# EAGLE design Gen7Extension (EAGLE 6.5.0)
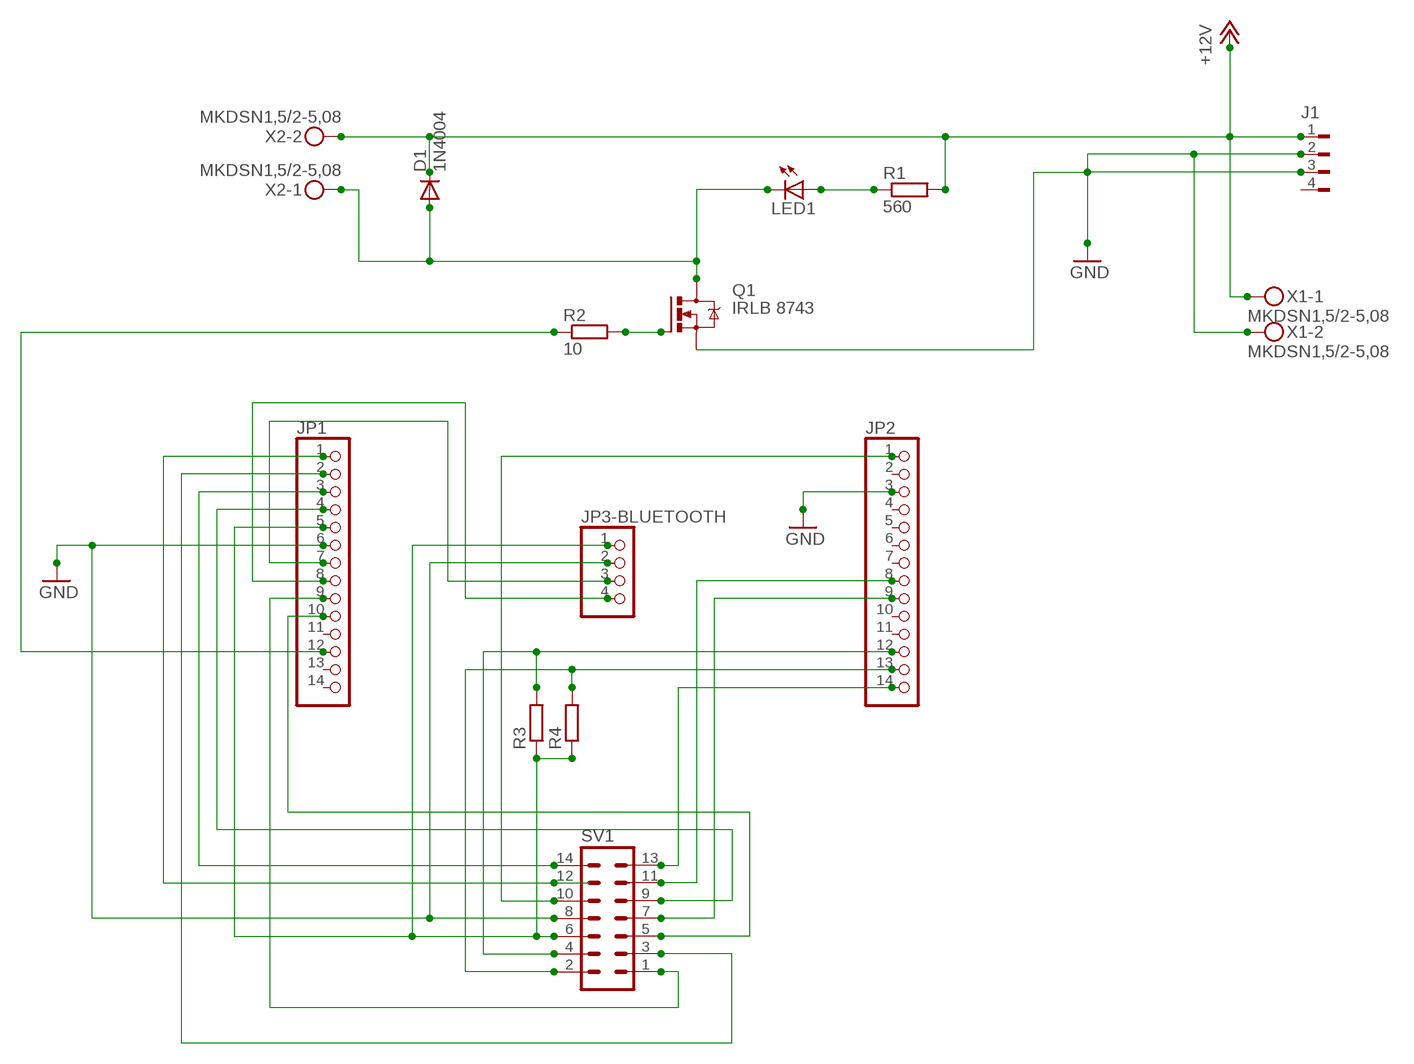
[diagram p0: schematic, sheet 1]

## Parts
D1  1N4004  [DO41-10]
J1  FLOPPY-4  [FLOPPY-4]
JP1  PINHD-1X14  [1X14]
JP2  PINHD-1X14  [1X14]
JP3-BLUETOOTH  PINHD-1X4  [1X04]
LED1  LED3MM  [LED3MM]
Q1  IRLB 8743  IRF530  [TO220BV]
R1  560  R-EU_0207/10  [0207/10]
R2  10  R-EU_0207/10  [0207/10]
R3  R-EU_0207/5V  [0207/5V]
R4  R-EU_0207/2V  [0207/2V]
SV1  ML14  [ML14]
X1  MKDSN1,5/2-5,08  [MKDSN1,5/2-5,08]
X2  MKDSN1,5/2-5,08  [MKDSN1,5/2-5,08]

## Nets
+12V: D1.C J1.1 R1.2 X1.1 X2.2
GND: J1.2 J1.3 JP1.6 JP2.3 JP3-BLUETOOTH.2 Q1.S SV1.8 X1.2
N$1: JP1.1 SV1.12
N$2: JP1.2 SV1.3
N$3: JP1.3 SV1.14
N$4: JP1.4 SV1.9
N$5: JP1.5 JP3-BLUETOOTH.1 R3.1 R4.1 SV1.6
N$6: JP1.7 JP3-BLUETOOTH.3
N$7: JP1.8 JP3-BLUETOOTH.4
N$8: D1.A LED1.K(C) Q1.D X2.1
N$9: LED1.A R1.1
N$10: JP1.12 R2.1
N$11: Q1.G R2.2
N$12: JP2.13 R4.2 SV1.2
N$13: JP2.12 R3.2 SV1.4
N$14: JP2.14 SV1.13
N$15: JP2.1 SV1.10
N$16: JP2.8 SV1.11
N$17: JP2.9 SV1.7
N$18: JP1.9 SV1.1
N$19: JP1.10 SV1.5
Unconnected: J1.4 JP1.11 JP1.13 JP1.14 JP2.2 JP2.4 JP2.5 JP2.6 JP2.7 JP2.10 JP2.11

## Library data of the parts
D1 = diode:1N4004: DIODE general purpose rectifier, 1 A
J1 = con-amp:FLOPPY-4: MATE N-LOCK Floppy / HDD conector Distributor: Bürklin 71F970
JP1 JP2 = pinhead:PINHD-1X14: PIN HEADER
JP3-BLUETOOTH = pinhead:PINHD-1X4: PIN HEADER
LED1 = led:LED: LED OSRAM: - CHIPLED LG R971, LG N971, LY N971, LG Q971, LY Q971, LO R971, LY R971 LH N974, LH R974 LS Q976, LO Q976, LY Q976 LO Q996 - Hyper CHIPLED LW Q18S LB Q993, LB Q99A, LB R99A - SideLED LS A670, LO A670, LY A670, LG A670, LP A670 LB A673, LV A673, LT A673, LW A673 LH A674 LY A675 LS A676, LA A676, LO A676, LY A676, LW A676 LS A679, LY A679, LG A679 - Hyper Micro SIDELED® LS Y876, LA Y876, LO Y876, LY Y876 LT Y87S - SmartLED LW L88C, LW L88S LB L89C, LB L89S, LG L890 LS L89K, LO L89K, LY L89K LS L896, LA L896, LO L896, LY L896 - TOPLED LS T670, LO T670, LY T670, LG T670, LP T670 LSG T670, LSP T670, LSY T670, LOP T670, LYG T670 LG T671, LOG T671, LSG T671 LB T673, LV T673, LT T673, LW T673 LH T674 LS T676, LA T676, LO T676, LY T676, LB T676, LH T676, LSB T676, LW T676 LB T67C, LV T67C, LT T67C, LS T67K, LO T67K, LY T67K, LW E67C LS E67B, LA E67B, LO E67B, LY E67B, LB E67C, LV E67C, LT E67C LW T67C LS T679, LY T679, LG T679 LS T770, LO T770, LY T770, LG T770, LP T770 LB T773, LV T773, LT T773, LW T773 LH T774 LS E675, LA E675, LY E675, LS T675 LS T776, LA T776, LO T776, LY T776, LB T776 LHGB T686 LT T68C, LB T68C - Hyper Mini TOPLED® LB M676 - Mini TOPLED Santana® LG M470 LS M47K, LO M47K, LY M47K Source: http://www.osram.convergy.de LUXEON: - LUMILED® LXK2-PW12-R00, LXK2-PW12-S00, LXK2-PW14-U00, LXK2-PW14-V00 LXK2-PM12-R00, LXK2-PM12-S00, LXK2-PM14-U00 LXK2-PE12-Q00, LXK2-PE12-R00, LXK2-PE12-S00, LXK2-PE14-T00, LXK2-PE14-U00 LXK2-PB12-K00, LXK2-PB12-L00, LXK2-PB12-M00, LXK2-PB14-N00, LXK2-PB14-P00, LXK2-PB14-Q00 LXK2-PR12-L00, LXK2-PR12-M00, LXK2-PR14-Q00, LXK2-PR14-R00 LXK2-PD12-Q00, LXK2-PD12-R00, LXK2-PD12-S00 LXK2-PH12-R00, LXK2-PH12-S00 LXK2-PL12-P00, LXK2-PL12-Q00, LXK2-PL12-R00 Source: www.luxeon.com KINGBRIGHT: KA-3528ASYC Source: www.kingbright.com
Q1 = transistor-power:IRF530: HEXFET Power MOSFET
R1-R4 = rcl:R-EU_: RESISTOR, European symbol
SV1 = con-harting-ml:ML14: HARTING; OC_FARNELL: unknown; OC_NEWARK: unknown
X1 X2 = con-phoenix-508:MKDSN1,5/2-5,08: MKDSN 1,5/ 2-5,08 Printklemme Nennstrom: 13,5 A Nennspannung: 250 V Rastermaß: 5,08 mm Polzahl: 2 Anschlussart: Schraubanschluss Montage: Löten Anschlussrichtung Leiter/Platine: 0 ° Artikelnummer: 1729128 Source: http://eshop.phoenixcontact.com .. 1729128.pdf; MPN: MKDSN 1,5/2-5.08; OC_FARNELL: 1792903; OC_NEWARK: 30M2397

## Net classes
0 default: clearance 0.205 mm

## Board
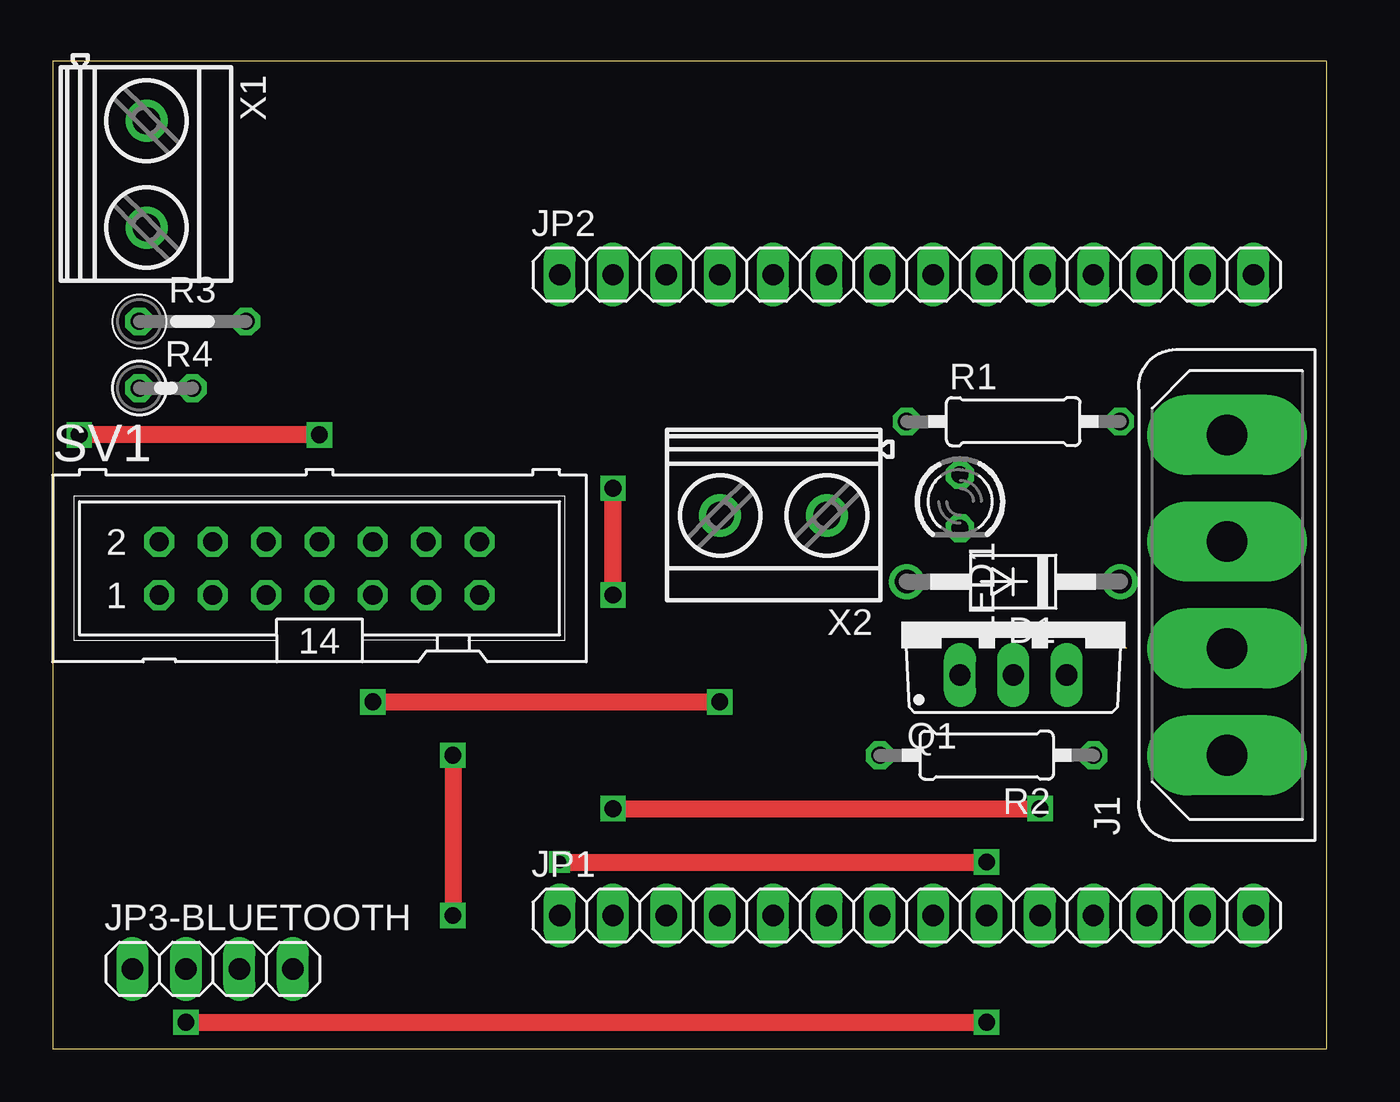
[diagram p1: board, top side]
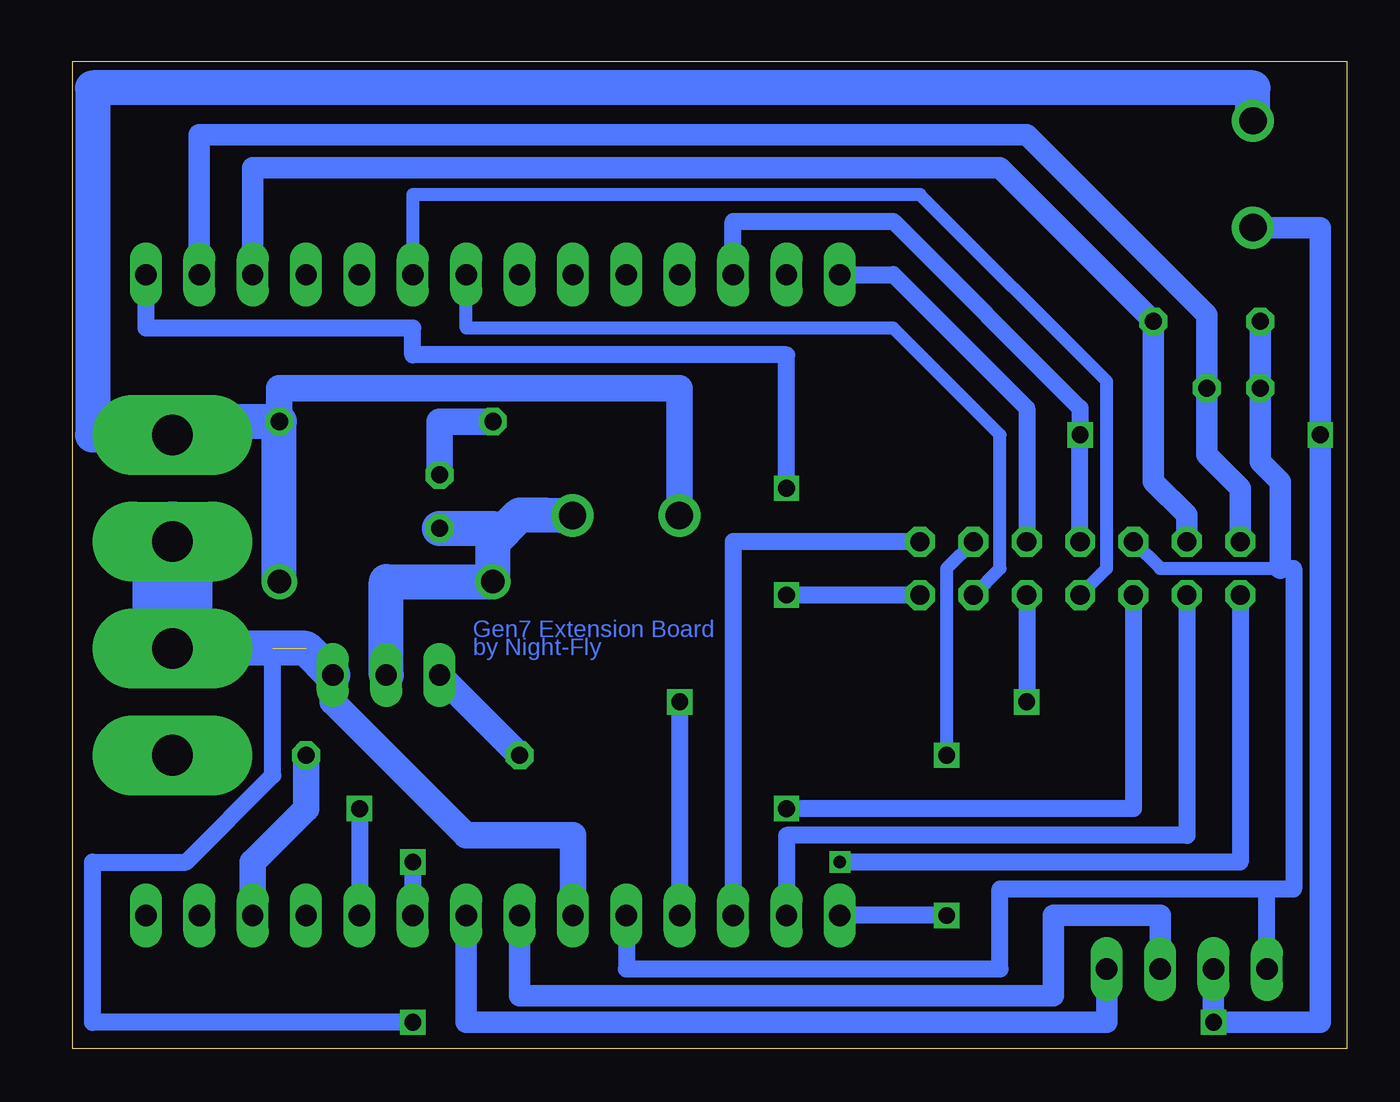
[diagram p2: board, bottom side, seen from below]

Size 60.63 x 46.98 mm. Coordinates in mm from the lower left corner, seen from the top.
Outline: 0,0 60.63,0 60.63,46.98 0,46.98 0,0
Copper layers (1*16): Top 0.035mm / dielectric 1.5mm / Bottom 0.035mm
Design rules "default": minimum track width 10mil, minimum drill 24mil, track to track 8mil, track to pad 8mil, pad to pad 8mil, via to via 8mil, smd to smd 8mil, copper to edge 40mil, drill to drill 8mil, minimum pad ring 10mil, minimum via ring 8mil, stop-mask expansion 4mil, vias tented up to drill 0mil, thermal gap 10mil

### Footprints (pad centres in the part's own frame; a part is rotated, then mirrored left to right if it is on the bottom)
DO41-10 = drill 1.118: A 5.08,0; C -5.08,0
FLOPPY-4 = drill 1.93 pad 3.81 long: 1 7.62,0; 2 2.54,0; 3 -2.54,0; 4 -7.62,0
1X14 = drill 1.016 long: 1 -16.51,0; 2 -13.97,0; 3 -11.43,0; 4 -8.89,0; 5 -6.35,0; 6 -3.81,0; 7 -1.27,0; 8 1.27,0; 9 3.81,0; 10 6.35,0; 11 8.89,0; 12 11.43,0; 13 13.97,0; 14 16.51,0
1X04 = drill 1.016 long: 1 -3.81,0; 2 -1.27,0; 3 1.27,0; 4 3.81,0
LED3MM = drill 0.813 octagon: A -1.27,0; K 1.27,0
TO220BV = drill 1.016 long: D 0,-2.54; G -2.54,-2.54; S 2.54,-2.54
0207/10 = drill 0.813 octagon: 1 -5.08,0; 2 5.08,0
0207/5V = drill 0.813 octagon: 1 -2.54,0; 2 2.54,0
0207/2V = drill 0.813 octagon: 1 -1.27,0; 2 1.27,0
ML14 = drill 0.914 octagon: 1 -7.62,-1.27; 2 -7.62,1.27; 3 -5.08,-1.27; 4 -5.08,1.27; 5 -2.54,-1.27; 6 -2.54,1.27; 7 0,-1.27; 8 0,1.27; 9 2.54,-1.27; 10 2.54,1.27; 11 5.08,-1.27; 12 5.08,1.27; 13 7.62,-1.27; 14 7.62,1.27
MKDSN1,5/2-5,08 = drill 1.3 pad 2: 1 -2.561,0.025; 2 2.519,0.025

### Placement (x,y rotation side)
D1  45.72,22.22 180 top
J1  55.88,21.59 90 top
JP1  40.64,6.35 0 top
JP2  40.64,36.83 0 top
JP3-BLUETOOTH  7.62,3.81 0 top
LED1  43.18,26.04 270 top
Q1  45.72,20.32 0 top
R1  45.72,29.84 0 top
R2  44.45,13.97 180 top
R3  6.67,34.61 0 top
R4  5.4,31.43 0 top
SV1  12.7,22.86 0 top
X1  4.45,41.59 270 top
X2  34.29,25.4 180 top

### Tracks (layer width: path | path; a pad name or v marks a point on that pad's centre or on a via)
+12V
  Bottom 1.27: X2.2 31.77,31.41 31.75,31.43 50.8,31.43 R1.2
  Bottom 1.676: D1.C R1.2 55.24,29.84 J1.1 59.69,29.21 59.69,45.72 4.47,45.72 X1.1
GND  (via drill 0.6, 0.8)  (1 unrouted)
  Top 0.813: v12.7,29.21 v1.27,29.21 | v6.35,1.27 v44.45,1.27
  Bottom 0.813: SV1.8 v12.7,29.21 12.7,30.48 21.59,39.37 29.21,39.37 JP2.3 | v44.45,1.27 59.69,1.27 59.69,8.89 55.24,8.89 51.12,13.02 51.12,19.05
  Bottom 1.016: JP3-BLUETOOTH.2 v6.35,1.27 1.27,1.27 v1.27,29.21 1.27,39.07 X1.2
  Bottom 1.27: JP1.6 36.83,10.16 41.91,10.16 48.26,16.51 Q1.S
  Bottom 1.676: Q1.S 49.53,19.05 J1.3
  Bottom 3.81: J1.3 J1.2
N$1  (via drill 0.6, 0.8)
  Top 0.813: v19.05,13.97 v19.05,6.35
  Bottom 0.61: SV1.12 19.05,22.86 v19.05,13.97
  Bottom 0.813: v19.05,6.35 JP1.1
N$2
  Bottom 0.813: SV1.3 7.62,10.16 26.67,10.16 JP1.2
N$3
  Bottom 0.813: SV1.14 29.21,24.13 JP1.3
N$4  (via drill 0.6, 0.8)
  Top 0.813: v15.24,16.51 v31.75,16.51
  Bottom 0.813: SV1.9 v15.24,16.51 | v31.75,16.51 JP1.4
N$5
  Bottom 0.61: SV1.6 8.89,22.86 3.17,22.86
  Bottom 0.813: 3.17,22.86 2.54,22.86 2.54,7.62 3.81,7.62 | JP1.5 34.29,3.81 16.51,3.81 16.51,7.62 3.81,7.62 | JP3-BLUETOOTH.1 3.81,7.62
  Bottom 1.016: R4.1 R3.1 4.13,27.94 3.17,26.99 3.17,22.86
N$6
  Bottom 1.016: JP3-BLUETOOTH.3 8.89,6.35 13.97,6.35 13.97,2.54 39.37,2.54 JP1.7
N$7
  Bottom 1.016: JP3-BLUETOOTH.4 11.43,1.27 41.91,1.27 JP1.8
N$8
  Bottom 1.676: LED1.K 40.64,24.77 40.64,24.13 | Q1.D 45.72,22.22 D1.A 40.64,24.13 | 40.64,24.13 39.37,25.4 38.15,25.4 X2.1
N$9
  Bottom 1.27: LED1.A 43.18,29.84 R1.1
N$10
  Bottom 1.27: R2.1 49.53,11.43 52.07,8.89 JP1.12
N$11
  Bottom 1.27: R2.2 Q1.G
N$12
  Bottom 1.016: JP2.13 54.61,43.5 15.24,43.5 6.67,34.93 R4.2 6.67,28.26 5.08,26.67 SV1.2
N$13
  Bottom 1.016: JP2.12 52.07,41.91 16.51,41.91 R3.2 9.21,26.99 7.62,25.4 SV1.4
N$14  (via drill 0.6, 0.8)
  Top 0.813: v26.67,21.59 v26.67,26.67
  Bottom 0.813: SV1.13 v26.67,21.59 | v26.67,26.67 26.67,33.02 44.45,33.02 44.45,34.29 57.15,34.29 JP2.14
N$15
  Bottom 0.813: JP2.1 21.59,36.83 15.24,30.48 SV1.10
N$16
  Bottom 0.61: SV1.11 16.51,22.86 16.51,29.21 21.59,34.29 41.91,34.29 JP2.8
N$17
  Bottom 0.61: SV1.7 11.43,22.86 11.43,31.75 20.32,40.64 44.45,40.64 JP2.9
N$18  (via drill 0.6, 0.8)
  Top 0.813: v24.13,8.89 v44.45,8.89
  Bottom 0.813: SV1.1 5.08,8.89 v24.13,8.89 | v44.45,8.89 JP1.9
N$19  (via drill 0.6, 0.8)
  Top 0.813: v26.67,11.43 v46.99,11.43
  Bottom 0.813: SV1.5 10.16,11.43 v26.67,11.43 | v46.99,11.43 JP1.10

### Text on the board
Bottom: Gen7 Extension Board / by Night-Fly